# Altium schematic sheet Estimador.SchDoc
size A4
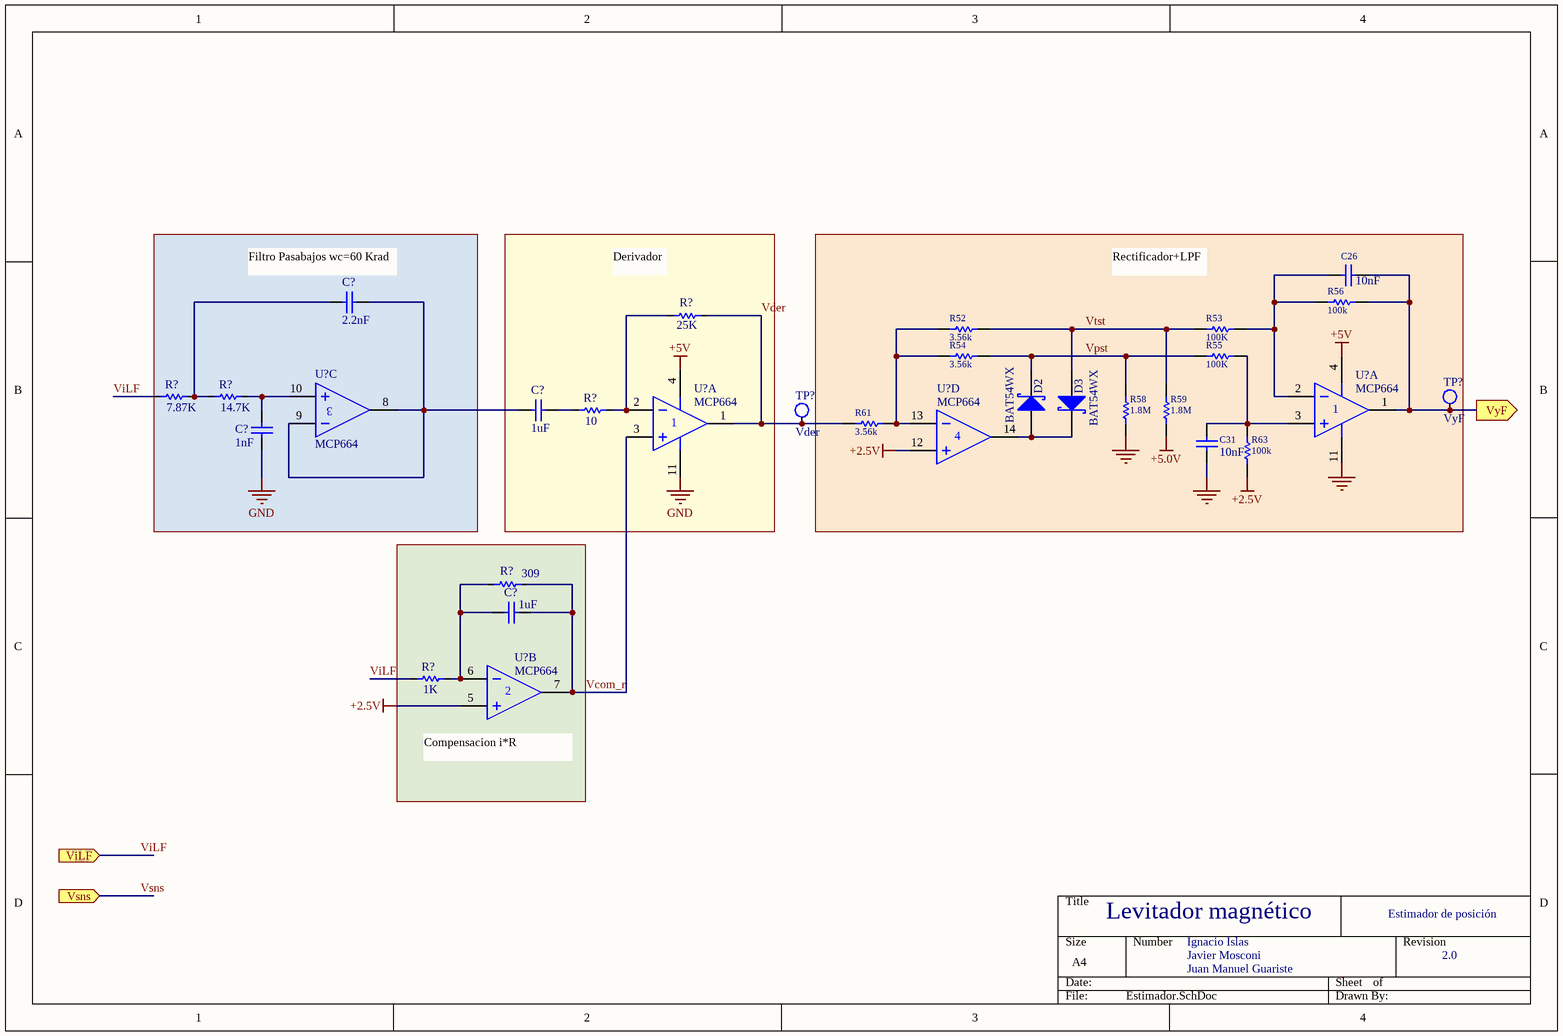
[diagram p0: Estimador.SchDoc]

## Parts
(Parts that share a designator on the sheet are numbered #1, #2 ... from top to bottom, then left to right.)
C26  10nF  [C1206]
C31  10nF  [C1206]
C?#1  value 2.2nF  [0603]  (hidden comment: Capacitor)
C?#2  value 1uF  [0603]  (hidden comment: Capacitor)
C?#3  value 1nF  [0603]  (hidden comment: Capacitor)
C?#4  value 1uF  [0603]  (hidden comment: Capacitor)
D2  BAT54WX  [SOD523]
D3  BAT54WX  [SOD523]
R52  3.56k  [R1206]
R53  100K  [R1206]
R54  3.56k  [R1206]
R55  100K  [R1206]
R56  100k  [R1206]
R58  1.8M  [R1206]
R59  1.8M  [R1206]
R61  3.56k  [R1206]
R63  100k  [R1206]
R?#1  value 25K  [0603]  (hidden comment: Resistencia)
R?#2  value 7.87K  [R 1206L]  (hidden comment: Resistencia)
R?#3  value 14.7K  [R 1206L]  (hidden comment: Resistencia)
R?#4  value 10  [0603]  (hidden comment: Resistencia)
R?#5  value 309  [0603]  (hidden comment: Resistencia)
R?#6  value 1K  [0603]  (hidden comment: Resistencia)
TP?#1  VyF  [TestPoint Keystone 5000 Silver-Red]
TP?#2  Vder  [TestPoint Keystone 5000 Silver-Red]
U?#1  MCP664  (part C of 4)
U?#2  MCP664  (part A of 4)
U?#3  MCP664  (part A of 4)
U?#4  MCP664  (part D of 4)
U?#5  MCP664  (part B of 4)

## Ports
ViLF (in), Vsns (in), VyF (out)

## Nets
+2.5V: R63.2 U?#4.12(IN+) U?#5.5(IN+)
+5.0V: R59.1
+5V: U?#2.4(V+) U?#3.4(V+)
GND: C31.1 C?#3.1 R58.1 U?#2.11(V-) U?#3.11(V-)
Vcom_r: C?#4.2 R?#5.2 U?#3.3(IN+) U?#5.7(OUT)
Vder: R61.1 R?#1.2 TP?#2.1 U?#3.1(OUT)
ViLF: R?#2.1 R?#6.1 ; port ViLF
Vpst: D2.2(K) R54.2 R55.2 R58.2
Vsns: port Vsns
Vtst: D3.1(A) R52.2 R53.2 R59.2
VyF: C26.1 R56.1 TP?#1.1 U?#2.1(OUT) ; port VyF
NetC26_2: C26.2 R53.1 R56.2 U?#2.2(IN-)
NetC31_2: C31.2 R55.1 R63.1 U?#2.3(IN+)
NetC?#1_1: C?#1.1 R?#2.2 R?#3.1
NetC?#1_2: C?#1.2 C?#2.1 U?#1.8(OUT) U?#1.9(IN-)
NetC?#2_2: C?#2.2 R?#4.1
NetC?#3_2: C?#3.2 R?#3.2 U?#1.10(IN+)
NetC?#4_1: C?#4.1 R?#5.1 R?#6.2 U?#5.6(IN-)
NetD2_1: D2.1(A) D3.2(K) U?#4.14(OUT)
NetR52_1: R52.1 R54.1 R61.2 U?#4.13(IN-)
NetR?#1_1: R?#1.1 R?#4.2 U?#3.2(IN-)

## Notes on the sheet
- (near C?#1) Filtro Pasabajos wc=60 Krad
- (near R?#1) Derivador
- Rectificador+LPF
- (near U?#5) Compensacion i*R
- Levitador magnético
- Estimador de posición
- Ignacio Islas
- Javier Mosconi
- Juan Manuel Guariste
- 2.0

## Library data of the parts
C26 C31 = C1206: Capacitor Chip 1206; Dielectric: NP0; Voltage: 50V; Published: 8-Jun-2000; LatestRevisionDate: 26/08/2013; LatestRevisionNote: IPC-7351 Footprint Added.; PackageReference: 1206; Publisher: Altium Limited; PackageDescription: Chip Capacitor; Supplier 1: Digi-Key; Value: 10nF
C?#1-C?#4 = Capacitor: Manufacturer: Generic Components; Class: Passive; Published: 08/06/2000; Publisher: Altium Hobart Technology Centre; SubClass: Capacitor
D2 D3 = Diode 10TQ035: Schottky Rectifier; Note: Terminal 2 is the TAB and is electrically connected to the cathode; Published: 8-Jun-2000; LatestRevisionDate: 17-Jul-2002; LatestRevisionNote: Re-released for DXP Platform.; DatasheetDocument: PD-2.057B; PackageDocument: Feb-1998; PackageReference: TO-220AC; Publisher: Altium Limited; ComponentLink1Description: Manufacturer Link; ComponentLink1URL: http://www.irf.com/; ComponentLink2Description: Datasheet; ComponentLink2URL: http://www.irf.com/product-info/datasheets/data/10tq.pdf
R52-R56 R58 R59 R61 R63 = R1206: Resistor Chip; 1/8W;; Published: 8-Jun-2000; LatestRevisionDate: 26/8/2013; PackageReference: 1206; Publisher: Altium Limited; PackageDescription: SMT Chip Resistor; Supplier 1: Digi-Key
  R52 R54 R61: Value: 3.56k
  R53 R55: Value: 100K
  R56 R63: Value: 100k
  R58 R59: Value: 1.8M
R?#1-R?#6 = Resistencia: Manufacturer: Generic Components; Class I: Passive; Class II: Resistor; Published: 8-Jun-2000; Revision: July-2002: Re-released for DXP Platform.; Publisher: Altium Limited
TP?#1 TP?#2 = Tespoint: Test point; Link: https://www.digikey.com/en/products/detail/keystone-electronics/5000/255326
U?#1-U?#5 = MCP664: Datasheet: https://ar.mouser.com/datasheet/2/268/22194B-77503.pdf